# EAGLE design rcx_hack_v2 (EAGLE 6.3)
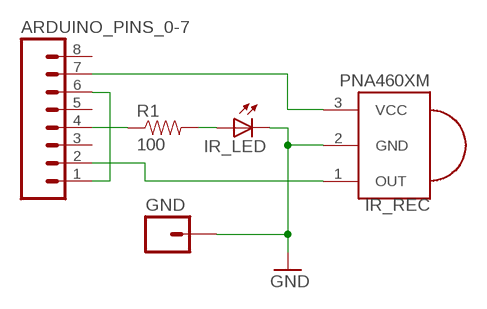
[diagram p0: schematic, sheet 1]

## Parts
ARDUINO_PINS_0-7  M08LOCK  [1X08_LOCK]
GND  M01PTH_LONGPAD  [1X01_LONGPAD]
IR_LED  LED5MM  [LED5MM]
IR_REC  PNA460XM  [PNA460XM]
R1  100  RESISTORAXIAL-0.3  [AXIAL-0.3]

## Nets
GND: GND.1 IR_LED.K(C) IR_REC.2(GND)
N$1: ARDUINO_PINS_0-7.2 IR_REC.1(OUT)
N$2: IR_LED.A R1.P$2
N$3: ARDUINO_PINS_0-7.4 R1.P$1
N$4: ARDUINO_PINS_0-7.7 IR_REC.3(VCC)
N$5: ARDUINO_PINS_0-7.1 ARDUINO_PINS_0-7.6
Unconnected: ARDUINO_PINS_0-7.3 ARDUINO_PINS_0-7.5 ARDUINO_PINS_0-7.8

## Library data of the parts
ARDUINO_PINS_0-7 = SparkFun-Connectors:M08: Header 8 Standard 8-pin 0.1" header. Use with straight break away headers (SKU : PRT-00116), right angle break away headers (PRT-00553), swiss pins (PRT-00743), machine pins (PRT-00117), and female headers (PRT-00115).
GND = SparkFun-Connectors:M01: Header 1 Standard 1-pin 0.1" header. Use with straight break away headers (SKU : PRT-00116), right angle break away headers (PRT-00553), swiss pins (PRT-00743), machine pins (PRT-00117), and female headers (PRT-00115).
IR_LED = SparkFun-LED:LED: LEDs Standard schematic elements and footprints for 5mm, 3mm, 1206, and 0603 sized LEDs. 5mm - Spark Fun Electronics SKU : COM-00529 (and others)
IR_REC = adafruit:PNA460XM: IR 38KHz receiver PNA4602 and related receivers http://www.ladyada.net/library/pcb/eaglelibrary.html
R1 = SparkFun-Passives:RESISTOR: Resistor Basic schematic elements and footprints for 0603, 1206, and PTH resistors.

## Board
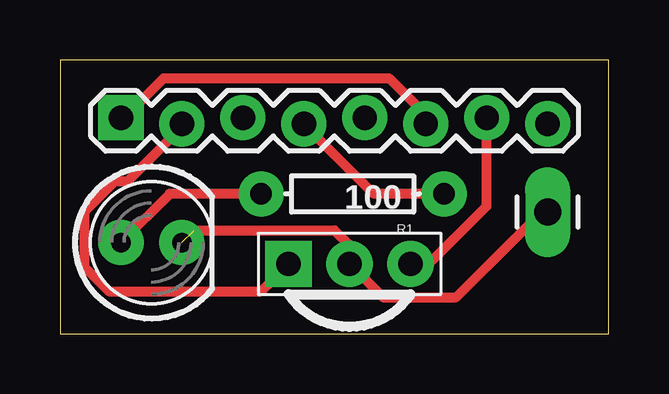
[diagram p1: board, top side]

Size 22.86 x 11.43 mm. Coordinates in mm from the lower left corner, seen from the top.
Outline: 0,0 22.86,0 22.86,11.43 0,11.43 0,0
Copper layers (1*16): Top 0.035mm / dielectric 1.5mm / Bottom 0.035mm
Design rules "default": minimum track width 10mil, minimum drill 24mil, track to track 8mil, track to pad 8mil, pad to pad 8mil, via to via 8mil, smd to smd 8mil, copper to edge 40mil, drill to drill 8mil, minimum pad ring 10mil, minimum via ring 8mil, stop-mask expansion 4mil, vias tented up to drill 0mil, thermal gap 10mil

### Footprints (pad centres in the part's own frame; a part is rotated, then mirrored left to right if it is on the bottom)
1X08_LOCK = drill 1.016 pad 1.88 square: 1 0,0.127 | drill 1.016 pad 1.88: 2 2.54,-0.127; 3 5.08,0.127; 4 7.62,-0.127; 5 10.16,0.127; 6 12.7,-0.127; 7 15.24,0.127; 8 17.78,-0.127
1X01_LONGPAD = drill 1.118 pad 1.88 long: 1 0,0
LED5MM = drill 0.813 pad 1.88: A -1.27,0; K 1.27,0
PNA460XM = drill 1.016 pad 1.93 square: 1 -2.54,0 | drill 1.016 pad 1.93: 2 0,0; 3 2.54,0
AXIAL-0.3 = drill 0.9 pad 1.88: P$1 -3.81,0; P$2 3.81,0

### Placement (x,y rotation side)
ARDUINO_PINS_0-7  2.54,8.89 0 top
GND  20.32,5.08 180 top
IR_LED  3.81,3.81 0 top
IR_REC  12.06,2.92 0 top
R1  12.19,5.84 180 top

### Tracks (layer width: path | path; a pad name or v marks a point on that pad's centre or on a via)
GND  (1 unrouted)
  Top 0.406: 5.59,4.32 11.43,4.32 12.06,3.68 IR_REC.2 13.46,1.52 16.51,1.52 20.07,5.08 GND.1
N$1
  Top 0.406: ARDUINO_PINS_0-7.2 5.08,8.64 2.79,6.35 2.29,6.35 1.02,5.08 1.02,2.79 2.03,1.78 8.38,1.78 IR_REC.1
N$2
  Top 0.406: R1.P$2 4.57,5.84 IR_LED.A
N$3
  Top 0.406: R1.P$1 13.08,5.84 ARDUINO_PINS_0-7.4
N$4
  Top 0.406: IR_REC.3 15.37,2.92 17.78,5.33 ARDUINO_PINS_0-7.7
N$5
  Top 0.406: ARDUINO_PINS_0-7.6 14.99,9.02 14.99,9.4 13.72,10.67 4.32,10.67 2.67,9.02 ARDUINO_PINS_0-7.1

### Text on the board
tDocu: 0
bDocu: LEGO RCX IR Hack v2.0 | 2014-02-08 | James Hagerman | 3Cent Devices